# EAGLE schematic DragonBoard-sub-board-backup (EAGLE 7.7.0)

## Sheet 1 of 3
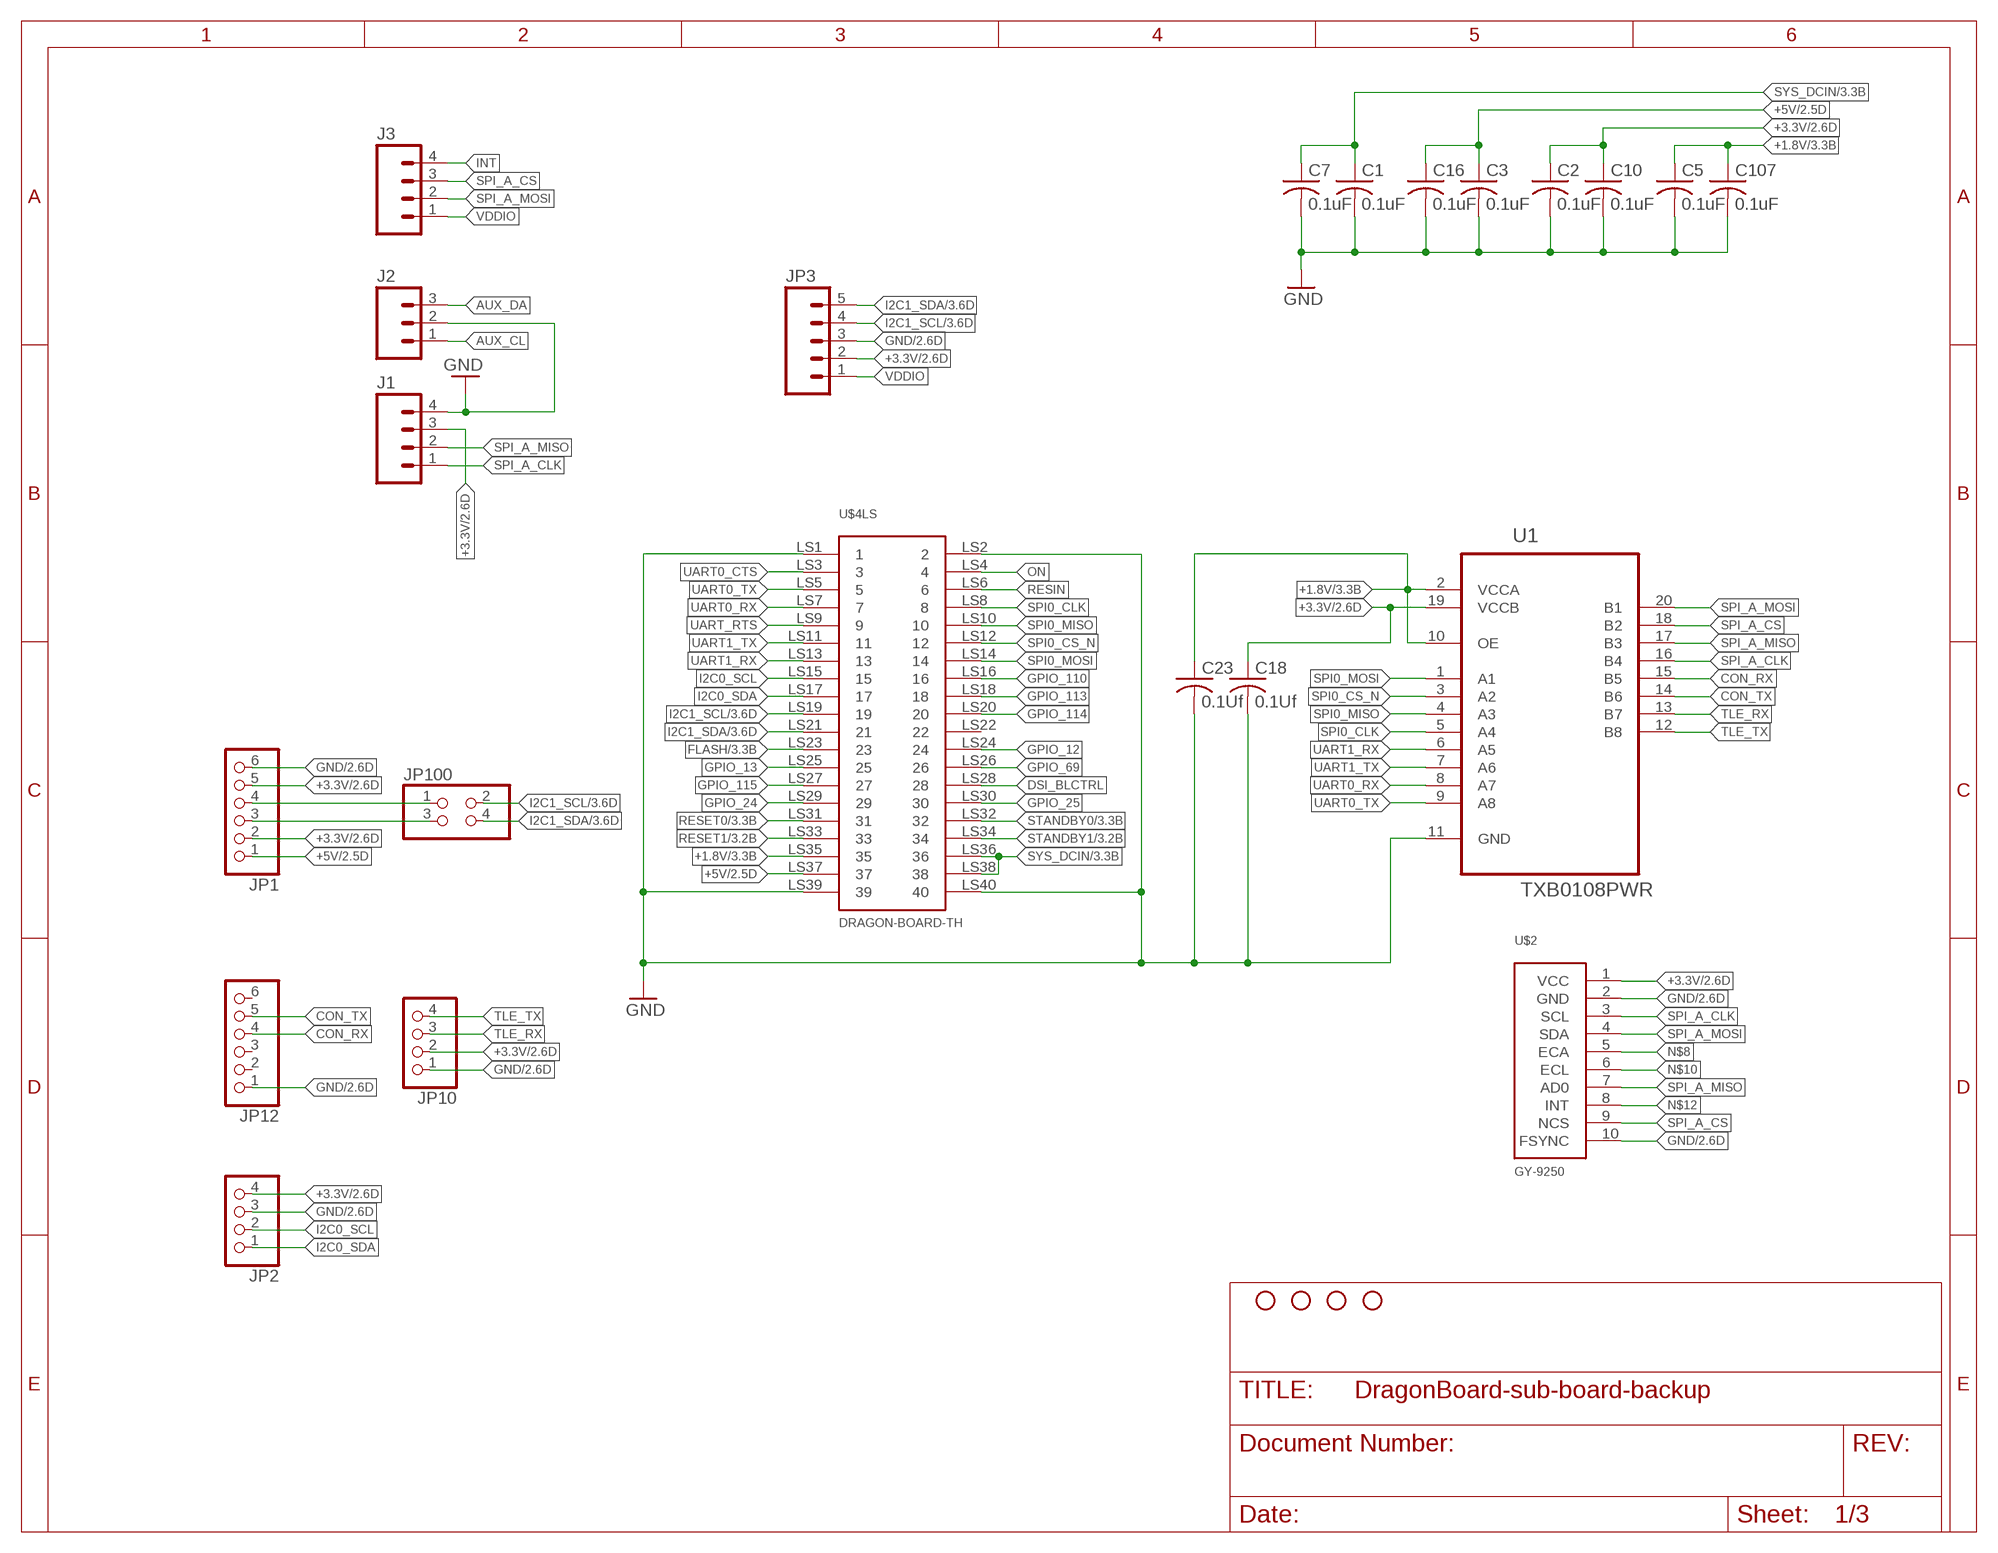
[diagram p0: schematic, sheet 1]

### Parts
C1  0.1uF  C-USC0402  [C0402]
C2  0.1uF  C-USC0402  [C0402]
C3  0.1uF  C-USC0402  [C0402]
C5  0.1uF  C-USC0402  [C0402]
C7  0.1uF  C-USC0402  [C0402]
C10  0.1uF  C-USC0402  [C0402]
C16  0.1uF  C-USC0402  [C0402]
C18  0.1Uf  C-USC0402  [C0402]
C23  0.1Uf  C-USC0402  [C0402]
C107  0.1uF  C-USC0402  [C0402]
J1  M04PTH  [1X04]
J2  M03PTH  [1X03]
J3  M04PTH  [1X04]
JP1  PINHD-1X6  [1X06]
JP2  PINHD-1X4  [1X04]
JP3  M05_ROUNDONLY_NOSILK  [1X05_ROUNDONLY_NOSILK]
JP10  PINHD-1X4  [1X04]
JP12  PINHD-1X6  [1X06]
JP100  PINHD-2X2  [2X02]
STANDOFF1  STAND-OFF  [STAND-OFF]
STANDOFF2  STAND-OFF  [STAND-OFF]
STANDOFF3  STAND-OFF  [STAND-OFF]
STANDOFF4  STAND-OFF  [STAND-OFF]
U1  TXB0108PWR  [SOP65P640X120-20N]
U$2  GY-9250  [IMU]
U$4  DRAGON-BOARD-TH  [DROGENBOARD-TH]

### Nets
+1.8V: C5.1 C23.1 C107.1 U1.2(VCCA) U1.10(OE) U$4.LS35 ; also sheet 3
+3.3V: C2.1 C10.1 C18.1 J1.3 JP1.2 JP1.5 JP2.4 JP3.2 JP10.2 U1.19(VCCB) U$2.1(VCC) ; also sheet 2,3
+5V: C3.1 C16.1 JP1.1 U$4.LS37 ; also sheet 2,3
AUX_CL: J2.1
AUX_DA: J2.3
CON_RX: JP12.4 U1.15(B5)
CON_TX: JP12.5 U1.14(B6)
DSI_BLCTRL: U$4.LS28
FLASH: U$4.LS23 ; also sheet 3
GND: C1.2 C2.2 C3.2 C5.2 C7.2 C10.2 C16.2 C18.2 C23.2 C107.2 J1.4 J2.2 JP1.6 JP2.3 JP3.3 JP10.1 JP12.1 U1.11(GND) U$2.2(GND) U$2.10(FSYNC) U$4.LS1 U$4.LS2 U$4.LS39 U$4.LS40 ; also sheet 2,3
GPIO_12: U$4.LS24
GPIO_13: U$4.LS25
GPIO_24: U$4.LS29
GPIO_25: U$4.LS30
GPIO_69: U$4.LS26
GPIO_110: U$4.LS16
GPIO_113: U$4.LS18
GPIO_114: U$4.LS20
GPIO_115: U$4.LS27
I2C0_SCL: JP2.2 U$4.LS15
I2C0_SDA: JP2.1 U$4.LS17
I2C1_SCL: JP3.4 JP100.2 U$4.LS19 ; also sheet 3
I2C1_SDA: JP3.5 JP100.4 U$4.LS21 ; also sheet 3
INT: J3.4
N$4: JP1.4 JP100.1
N$5: JP1.3 JP100.3
N$8: U$2.5(ECA)
N$10: U$2.6(ECL)
N$12: U$2.8(INT)
ON: U$4.LS4
RESET0: U$4.LS31 ; also sheet 3
RESET1: U$4.LS33 ; also sheet 3
RESIN: U$4.LS6
SPI0_CLK: U1.5(A4) U$4.LS8
SPI0_CS_N: U1.3(A2) U$4.LS12
SPI0_MISO: U1.4(A3) U$4.LS10
SPI0_MOSI: U1.1(A1) U$4.LS14
SPI_A_CLK: J1.1 U1.16(B4) U$2.3(SCL)
SPI_A_CS: J3.3 U1.18(B2) U$2.9(NCS)
SPI_A_MISO: J1.2 U1.17(B3) U$2.7(AD0)
SPI_A_MOSI: J3.2 U1.20(B1) U$2.4(SDA)
STANDBY0: U$4.LS32 ; also sheet 3
STANDBY1: U$4.LS34 ; also sheet 3
SYS_DCIN: C1.1 C7.1 U$4.LS36 U$4.LS38 ; also sheet 3
TLE_RX: JP10.3 U1.13(B7)
TLE_TX: JP10.4 U1.12(B8)
UART0_CTS: U$4.LS3
UART0_RX: U1.8(A7) U$4.LS7
UART0_TX: U1.9(A8) U$4.LS5
UART1_RX: U1.6(A5) U$4.LS13
UART1_TX: U1.7(A6) U$4.LS11
UART_RTS: U$4.LS9
VDDIO: J3.1 JP3.1
Unconnected: JP12.2 JP12.3 JP12.6 U$4.LS22

## Sheet 2 of 3
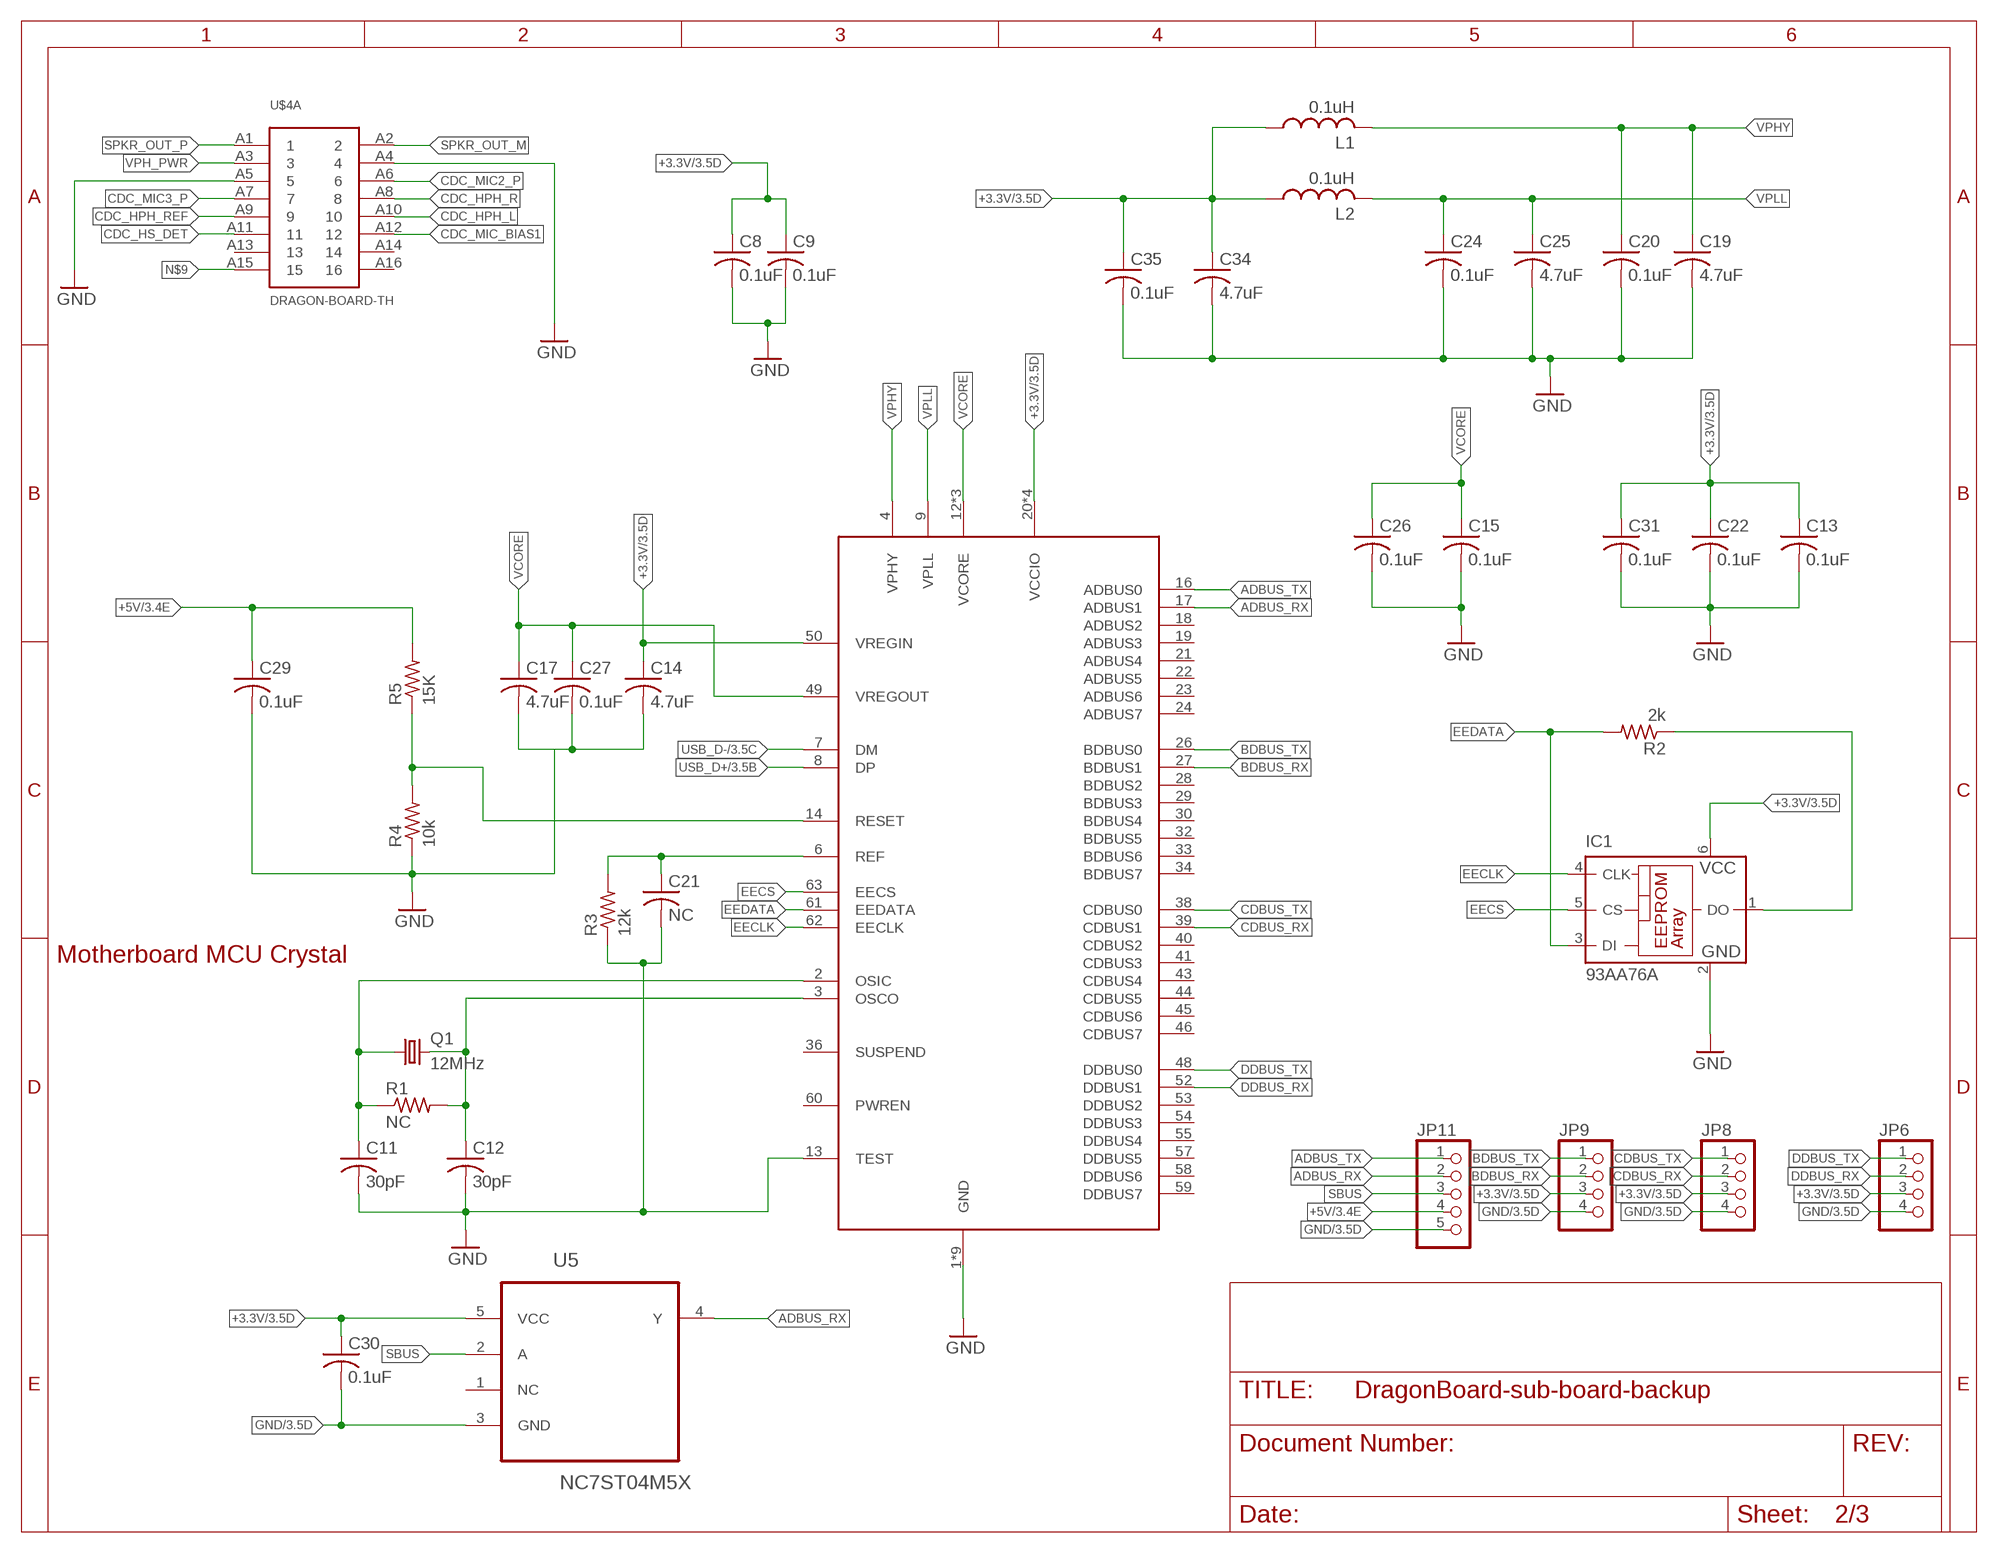
[diagram p1: schematic, sheet 2]

### Parts
C8  0.1uF  C-USC0805  [C0805]
C9  0.1uF  C-USC0805  [C0805]
C11  30pF  C-USC0402  [C0402]
C12  30pF  C-USC0402  [C0402]
C13  0.1uF  C-USC0402  [C0402]
C14  4.7uF  C-USC0402  [C0402]
C15  0.1uF  C-USC0402  [C0402]
C17  4.7uF  C-USC0402  [C0402]
C19  4.7uF  C-USC0402  [C0402]
C20  0.1uF  C-USC0402  [C0402]
C21  NC  C-USC0402  [C0402]
C22  0.1uF  C-USC0402  [C0402]
C24  0.1uF  C-USC0402  [C0402]
C25  4.7uF  C-USC0402  [C0402]
C26  0.1uF  C-USC0402  [C0402]
C27  0.1uF  C-USC0402  [C0402]
C29  0.1uF  C-USC0402  [C0402]
C30  0.1uF  C-USC0402  [C0402]
C31  0.1uF  C-USC0402  [C0402]
C34  4.7uF  C-USC0402  [C0402]
C35  0.1uF  C-USC0402  [C0402]
IC1  93AA76A  [SOT23-6]
JP6  PINHD-1X4  [1X04]
JP8  PINHD-1X4  [1X04]
JP9  PINHD-1X4  [1X04]
JP11  PINHD-1X5  [1X05]
L1  0.1uH  L-USL3216C  [L3216C]
L2  0.1uH  L-USL3216C  [L3216C]
Q1  12MHz  CRYSTALCTS406  [CTS406]
R1  NC  R-US_R0402  [R0402]
R2  2k  R-US_R0402  [R0402]
R3  12k  R-US_R0402  [R0402]
R4  10k  R-US_R0402  [R0402]
R5  15K  R-US_R0402  [R0402]
U5  NC7ST04M5X  [SOT95P280X145-5N]
U$3  FT423H  [LQFP-64]

### Nets
+3.3V: C8.1 C9.1 C13.1 C14.1 C22.1 C30.1 C31.1 C34.1 C35.1 IC1.6(VCC) JP6.3 JP8.3 JP9.3 L1.1 L2.1 U5.5(VCC) U$3.20(VCCIO) U$3.31(VCCIO) U$3.42(VCCIO) U$3.50(VREGIN) U$3.56(VCCIO) ; also sheet 1,3
+5V: C29.1 JP11.4 R5.2 ; also sheet 1,3
ADBUS_RX: JP11.2 U5.4(Y) U$3.17(ADBUS1)
ADBUS_TX: JP11.1 U$3.16(ADBUS0)
BDBUS_RX: JP9.2 U$3.27(BDBUS1)
BDBUS_TX: JP9.1 U$3.26(BDBUS0)
CDBUS_RX: JP8.2 U$3.39(CDBUS1)
CDBUS_TX: JP8.1 U$3.38(CDBUS0)
CDC_HPH_L: U$4.A10
CDC_HPH_R: U$4.A8
CDC_HPH_REF: U$4.A9
CDC_HS_DET: U$4.A11
CDC_MIC2_P: U$4.A6
CDC_MIC3_P: U$4.A7
CDC_MIC_BIAS1: U$4.A12
DDBUS_RX: JP6.2 U$3.52(DDBUS1)
DDBUS_TX: JP6.1 U$3.48(DDBUS0)
EECLK: IC1.4(CLK) U$3.62(EECLK)
EECS: IC1.5(CS) U$3.63(EECS)
EEDATA: IC1.3(DI) R2.2 U$3.61(EEDATA)
GND: C8.2 C9.2 C11.2 C12.2 C13.2 C14.2 C15.2 C17.2 C19.2 C20.2 C21.2 C22.2 C24.2 C25.2 C26.2 C27.2 C29.2 C30.2 C31.2 C34.2 C35.2 IC1.2(GND) JP6.4 JP8.4 JP9.4 JP11.5 R3.1 R4.1 U5.3(GND) U$3.1(GND) U$3.5(GND) U$3.10(GND) U$3.11(GND) U$3.13(TEST) U$3.15(GND) U$3.25(GND) U$3.35(GND) U$3.47(GND) U$3.51(GND) U$4.A4 U$4.A5 ; also sheet 1,3
N$6: C21.1 R3.2 U$3.6(REF)
N$7: C11.1 Q1.1 R1.1 U$3.2(OSIC)
N$9: U$4.A15
N$11: C12.1 Q1.3 R1.2 U$3.3(OSCO)
N$14: IC1.1(DO) R2.1
N$17: R4.2 R5.1 U$3.14(RESET)
SBUS: JP11.3 U5.2(A)
SPKR_OUT_M: U$4.A2
SPKR_OUT_P: U$4.A1
USB_D+: U$3.8(DP) ; also sheet 3
USB_D-: U$3.7(DM) ; also sheet 3
VCORE: C15.1 C17.1 C26.1 C27.1 U$3.12(VCORE) U$3.37(VCORE) U$3.49(VREGOUT) U$3.64(VCORE)
VPH_PWR: U$4.A3
VPHY: C19.1 C20.1 L1.2 U$3.4(VPHY)
VPLL: C24.1 C25.1 L2.2 U$3.9(VPLL)
Unconnected: U5.1(NC) U$3.18(ADBUS2) U$3.19(ADBUS3) U$3.21(ADBUS4) U$3.22(ADBUS5) U$3.23(ADBUS6) U$3.24(ADBUS7) U$3.28(BDBUS2) U$3.29(BDBUS3) U$3.30(BDBUS4) U$3.32(BDBUS5) U$3.33(BDBUS6) U$3.34(BDBUS7) U$3.36(SUSPEND) U$3.40(CDBUS2) U$3.41(CDBUS3) U$3.43(CDBUS4) U$3.44(CDBUS5) U$3.45(CDBUS6) U$3.46(CDBUS7) U$3.53(DDBUS2) U$3.54(DDBUS3) U$3.55(DDBUS4) U$3.57(DDBUS5) U$3.58(DDBUS6) U$3.59(DDBUS7) U$3.60(PWREN) U$4.A13 U$4.A14 U$4.A16

### Notes on the sheet
- Motherboard MCU Crystal

## Sheet 3 of 3
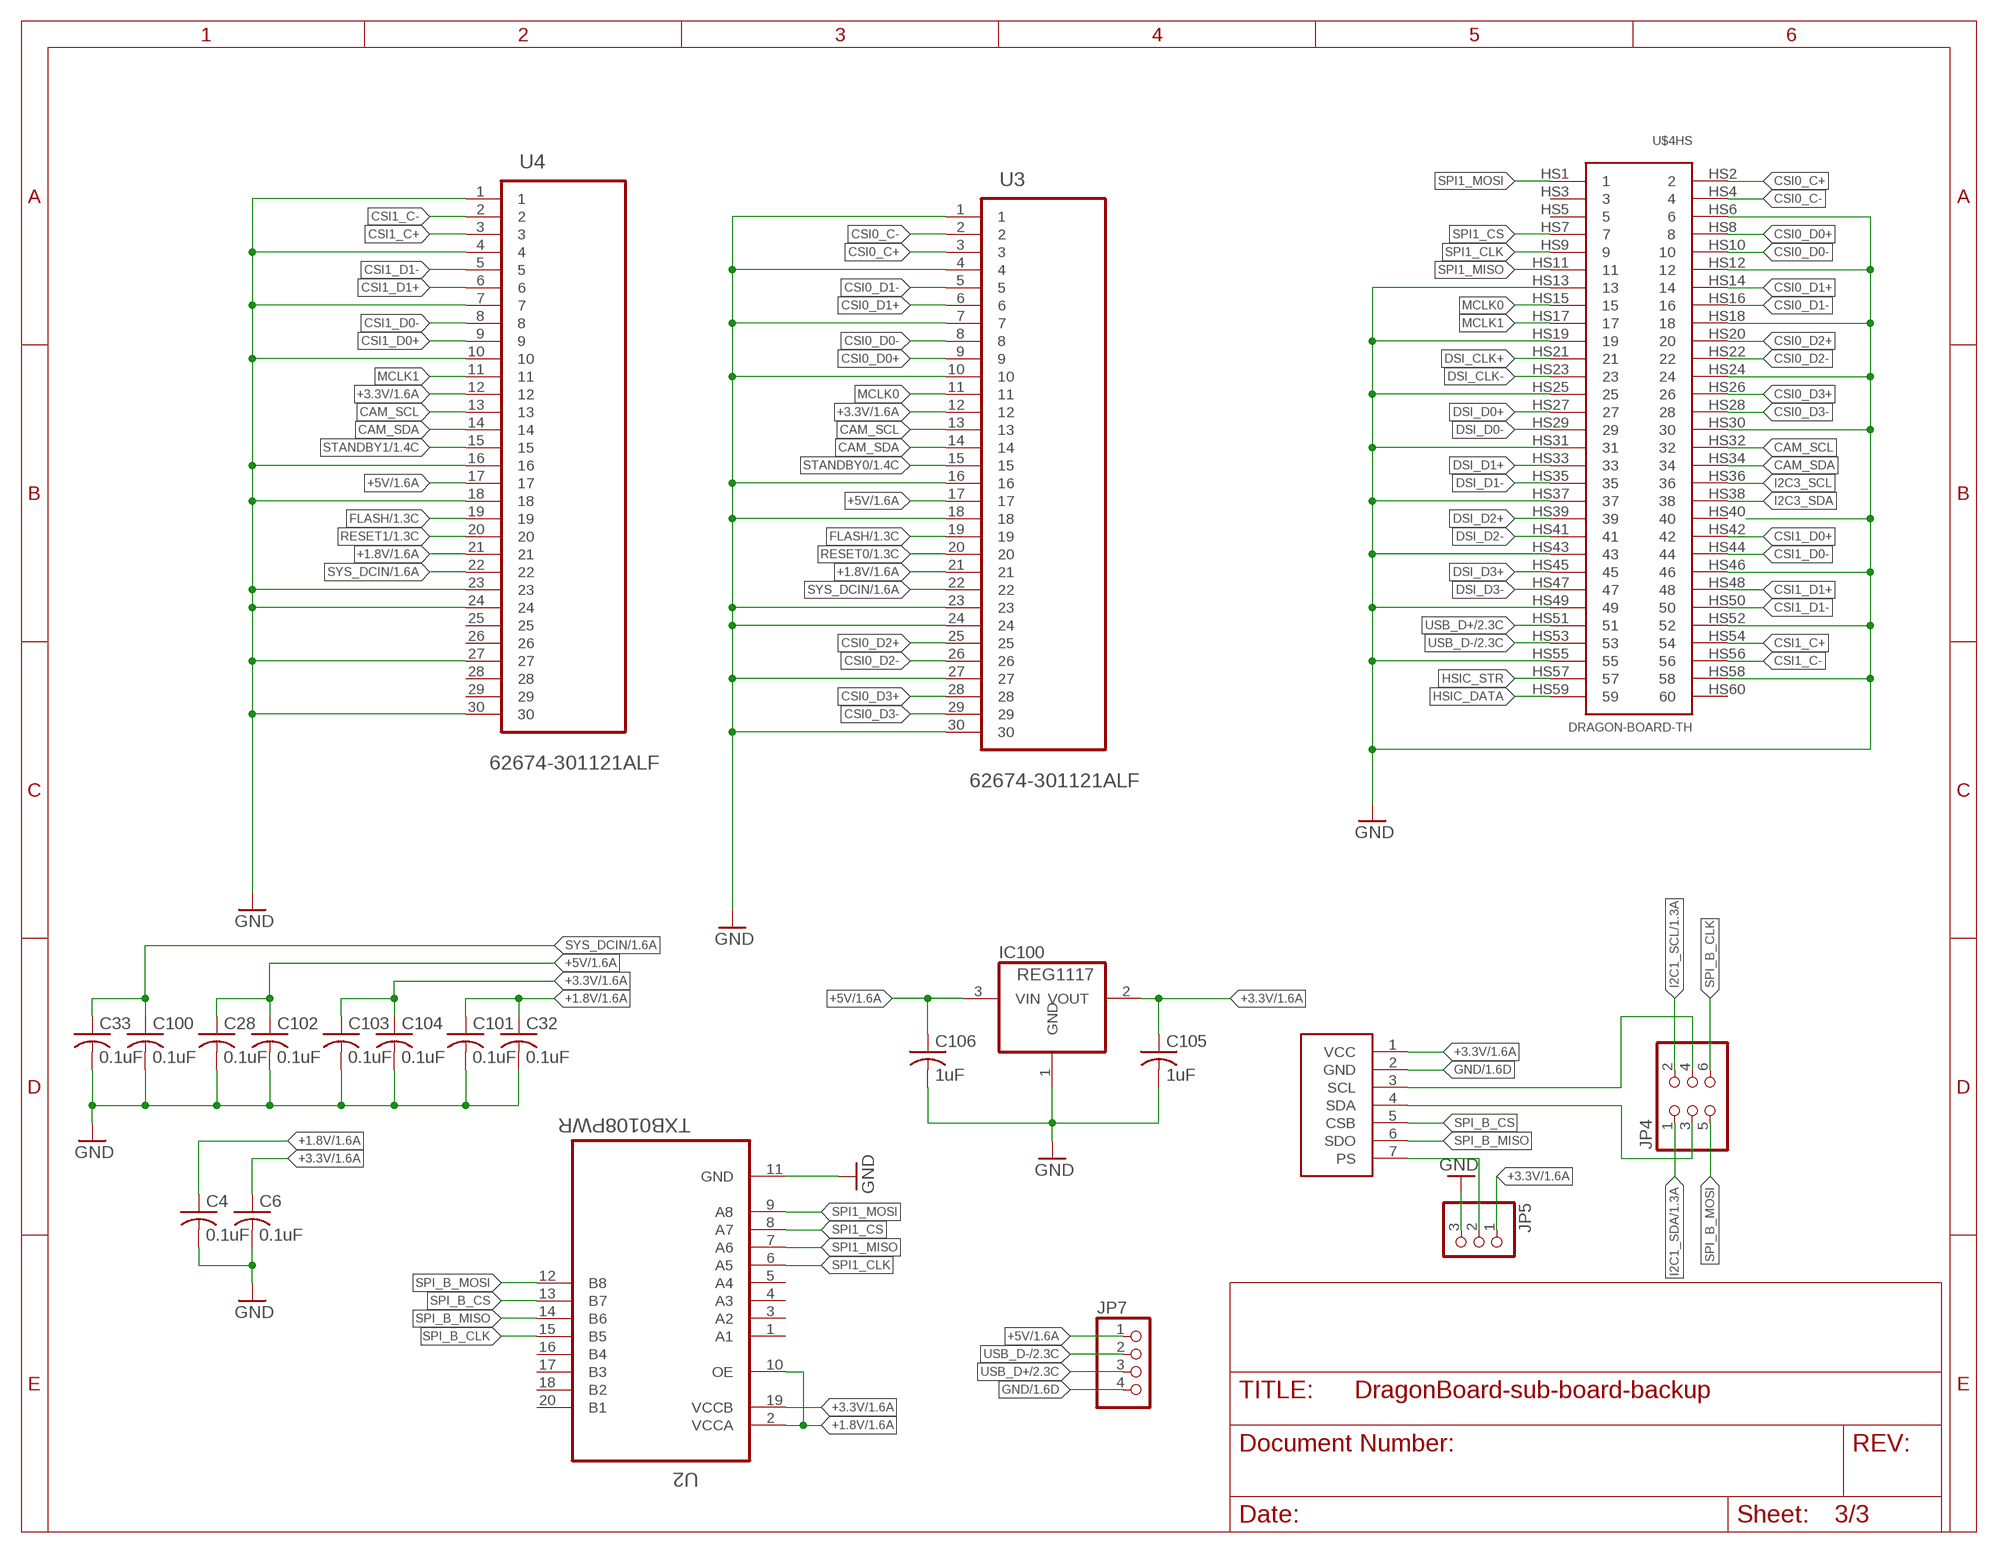
[diagram p2: schematic, sheet 3]

### Parts
C4  0.1uF  C-USC0402  [C0402]
C6  0.1uF  C-USC0402  [C0402]
C28  0.1uF  C-USC0402  [C0402]
C32  0.1uF  C-USC0402  [C0402]
C33  0.1uF  C-USC0402  [C0402]
C100  0.1uF  C-USC0402  [C0402]
C101  0.1uF  C-USC0402  [C0402]
C102  0.1uF  C-USC0402  [C0402]
C103  0.1uF  C-USC0402  [C0402]
C104  0.1uF  C-USC0402  [C0402]
C105  1uF  C-USC0402  [C0402]
C106  1uF  C-USC0402  [C0402]
IC100  REG1117  [SOT223]
JP4  PINHD-2X3  [2X03]
JP5  PINHD-1X3  [1X03]
JP7  PINHD-1X4  [1X04]
U2  TXB0108PWR  [SOP65P640X120-20N]
U3  62674-301121ALF  [FCI_62674-301121ALF]
U4  62674-301121ALF  [FCI_62674-301121ALF]
U$1  GY-63  [BURO]

### Nets
+1.8V: C4.1 C32.1 C101.1 U2.2(VCCA) U2.10(OE) U3.21 U4.21 ; also sheet 1
+3.3V: C6.1 C103.1 C104.1 C105.1 IC100.2(VOUT) JP5.1 U2.19(VCCB) U3.12 U4.12 U$1.1(VCC) ; also sheet 1,2
+5V: C28.1 C102.1 C106.1 IC100.3(VIN) JP7.1 U3.17 U4.17 ; also sheet 1,2
CAM_SCL: U3.13 U4.13 U$4.HS32
CAM_SDA: U3.14 U4.14 U$4.HS34
CSI0_C+: U3.3 U$4.HS2
CSI0_C-: U3.2 U$4.HS4
CSI0_D0+: U3.9 U$4.HS8
CSI0_D0-: U3.8 U$4.HS10
CSI0_D1+: U3.6 U$4.HS14
CSI0_D1-: U3.5 U$4.HS16
CSI0_D2+: U3.25 U$4.HS20
CSI0_D2-: U3.26 U$4.HS22
CSI0_D3+: U3.28 U$4.HS26
CSI0_D3-: U3.29 U$4.HS28
CSI1_C+: U4.3 U$4.HS54
CSI1_C-: U4.2 U$4.HS56
CSI1_D0+: U4.9 U$4.HS42
CSI1_D0-: U4.8 U$4.HS44
CSI1_D1+: U4.6 U$4.HS48
CSI1_D1-: U4.5 U$4.HS50
DSI_CLK+: U$4.HS21
DSI_CLK-: U$4.HS23
DSI_D0+: U$4.HS27
DSI_D0-: U$4.HS29
DSI_D1+: U$4.HS33
DSI_D1-: U$4.HS35
DSI_D2+: U$4.HS39
DSI_D2-: U$4.HS41
DSI_D3+: U$4.HS45
DSI_D3-: U$4.HS47
FLASH: U3.19 U4.19 ; also sheet 1
GND: C4.2 C6.2 C28.2 C32.2 C33.2 C100.2 C101.2 C102.2 C103.2 C104.2 C105.2 C106.2 IC100.1(GND) JP5.3 JP7.4 U2.11(GND) U3.1 U3.4 U3.7 U3.10 U3.16 U3.18 U3.23 U3.24 U3.27 U3.30 U4.1 U4.4 U4.7 U4.10 U4.16 U4.18 U4.23 U4.24 U4.27 U4.30 U$1.2(GND) U$4.HS6 U$4.HS12 U$4.HS13 U$4.HS18 U$4.HS19 U$4.HS24 U$4.HS25 U$4.HS30 U$4.HS31 U$4.HS37 U$4.HS43 U$4.HS46 U$4.HS49 U$4.HS52 U$4.HS55 U$4.HS58 ; also sheet 1,2
HSIC_DATA: U$4.HS59
HSIC_STR: U$4.HS57
I2C1_SCL: JP4.2 ; also sheet 1
I2C1_SDA: JP4.1 ; also sheet 1
I2C3_SCL: U$4.HS36
I2C3_SDA: U$4.HS38
MCLK0: U3.11 U$4.HS15
MCLK1: U4.11 U$4.HS17
N$1: JP5.2 U$1.7(PS)
N$2: JP4.3 U$1.4(SDA)
N$3: JP4.4 U$1.3(SCL)
RESET0: U3.20 ; also sheet 1
RESET1: U4.20 ; also sheet 1
SPI1_CLK: U2.6(A5) U$4.HS9
SPI1_CS: U2.8(A7) U$4.HS7
SPI1_MISO: U2.7(A6) U$4.HS11
SPI1_MOSI: U2.9(A8) U$4.HS1
SPI_B_CLK: JP4.6 U2.15(B5)
SPI_B_CS: U2.13(B7) U$1.5(CSB)
SPI_B_MISO: U2.14(B6) U$1.6(SDO)
SPI_B_MOSI: JP4.5 U2.12(B8)
STANDBY0: U3.15 ; also sheet 1
STANDBY1: U4.15 ; also sheet 1
SYS_DCIN: C33.1 C100.1 U3.22 U4.22 ; also sheet 1
USB_D+: JP7.3 U$4.HS51 ; also sheet 2
USB_D-: JP7.2 U$4.HS53 ; also sheet 2
Unconnected: U2.1(A1) U2.3(A2) U2.4(A3) U2.5(A4) U2.16(B4) U2.17(B3) U2.18(B2) U2.20(B1) U4.25 U4.26 U4.28 U4.29 U$4.HS3 U$4.HS5 U$4.HS40 U$4.HS60

## Library data of the parts
C1-C35 C100-C107 = rcl:C-US: CAPACITOR, American symbol
IC1 = microchip:93*76?: 8K Microwire Compatible Serial EEPROM Source: http://ww1.microchip.com/downloads/en/DeviceDoc/21796H.pdf; MPN: 93AA76AT-I/OT; OC_FARNELL: 1331443; OC_NEWARK: 35M2481
IC100 = burr-brown:REG1117: 800mA and 1A Low Dropout (LDO) Positive Regulator 1.8V, 2.5V, 2.85V, 3.3V, 5V, and Adj; MPN: REG1117; OC_FARNELL: 1097566; OC_NEWARK: 14P6981
J1 J3 = SparkFun-Connectors:M04: Header 4 Standard 4-pin 0.1" header. Use with straight break away headers (SKU : PRT-00116), right angle break away headers (PRT-00553), swiss pins (PRT-00743), machine pins (PRT-00117), and female headers (PRT-00115). Molex polarized connector foot print use with SKU : PRT-08231 with associated crimp pins and housings. 1MM SMD Version SKU: PRT-10208; PROD_ID: CONN-09696
J2 = SparkFun-Connectors:M03: Header 3 Standard 3-pin 0.1" header. Use with straight break away headers (SKU : PRT-00116), right angle break away headers (PRT-00553), swiss pins (PRT-00743), machine pins (PRT-00117), and female headers (PRT-00115). Molex polarized connector foot print use with SKU : PRT-08232 with associated crimp pins and housings.
JP1 JP12 = pinhead:PINHD-1X6: PIN HEADER
JP2 JP6-JP10 = pinhead:PINHD-1X4: PIN HEADER
JP3 = mike-temp:M05: Header 5 Standard 5-pin 0.1" header. Use with straight break away headers (SKU : PRT-00116), right angle break away headers (PRT-00553), swiss pins (PRT-00743), machine pins (PRT-00117), and female headers (PRT-00115). Molex polarized connector foot print use with SKU : PRT-08230 with associated crimp pins and housings.
JP4 = pinhead:PINHD-2X3: PIN HEADER
JP5 = pinhead:PINHD-1X3: PIN HEADER
JP11 = pinhead:PINHD-1X5: PIN HEADER
JP100 = pinhead:PINHD-2X2: PIN HEADER
L1 L2 = rcl:L-US: INDUCTOR, American symbol
Q1 = crystal:CRYSTAL: CRYSTAL; OC_FARNELL: unknown; OC_NEWARK: unknown
R1-R5 = rcl:R-US_: RESISTOR, American symbol
STANDOFF1-STANDOFF4 = SparkFun-Electromechanical:STAND-OFF: #4 Stand Off This is the mechanical footprint for a #4 phillips button head screw. Use the keepout ring to avoid running the screw head into surrounding components. SKU : PRT-00447
U1 U2 = Texas Instruments_By_element14_Batch_1:TXB0108PWR: 8-BIT BIDIRECTIONAL VOLTAGE-LEVEL TRANSLATOR; MPN: TXB0108PWR; OC_FARNELL: 1494945; OC_NEWARK: 27M1151; PACKAGE: TSSOP-20; SUPPLIER: Texas Instruments
U3 U4 = 62674-301121ALF:62674-301121ALF: CONN FPC/FFC 30POS .5MM VERT SMD; MPN: 62674-301121ALF; OC_FARNELL: 1830632; OC_NEWARK: 03M2163; PACKAGE: CONN-30POS; SUPPLIER: FCI
U5 = pca9685:NC7ST04M5X: TinyLogic HST Inverter; MPN: NC7ST04M5X; OC_FARNELL: -; OC_NEWARK: 38C7556; PACKAGE: SOT-23-5; SUPPLIER: Fairchild
U$1 = imu:GY-63
U$2 = imu:GY-9250
U$3 = FT432H:FT423H
U$4 = DragonBoard:DRAGON-BOARD-TH

## Net classes
3 gnd: width 0.152 mm